# Altium schematic sheet SoC_PS_504_DDR4.SchDoc: RFSoC AMC
size 420 x 297 mm; CompanyName: WUT; DrawnBy: T. Przywozki; Organization: WUT ISE; Address1: Warsaw University of Technology; Address2: Nowowiejska 15/19 00-665 Warsaw; Address3: Tomasz.Przywozki@pw.edu.pl; DocumentNumber: 10; Revision: 1; SheetNumber: 10; SheetTotal: 45; Project: RFSoC AMC; ModifiedBy: T. Przywozki; CreateDate: -; CheckedDate: -; DivGrp: ISE; Designer: T. Przywozki; ModifiedDate: -; ProjectName: ADC/DAC MEZZANINE
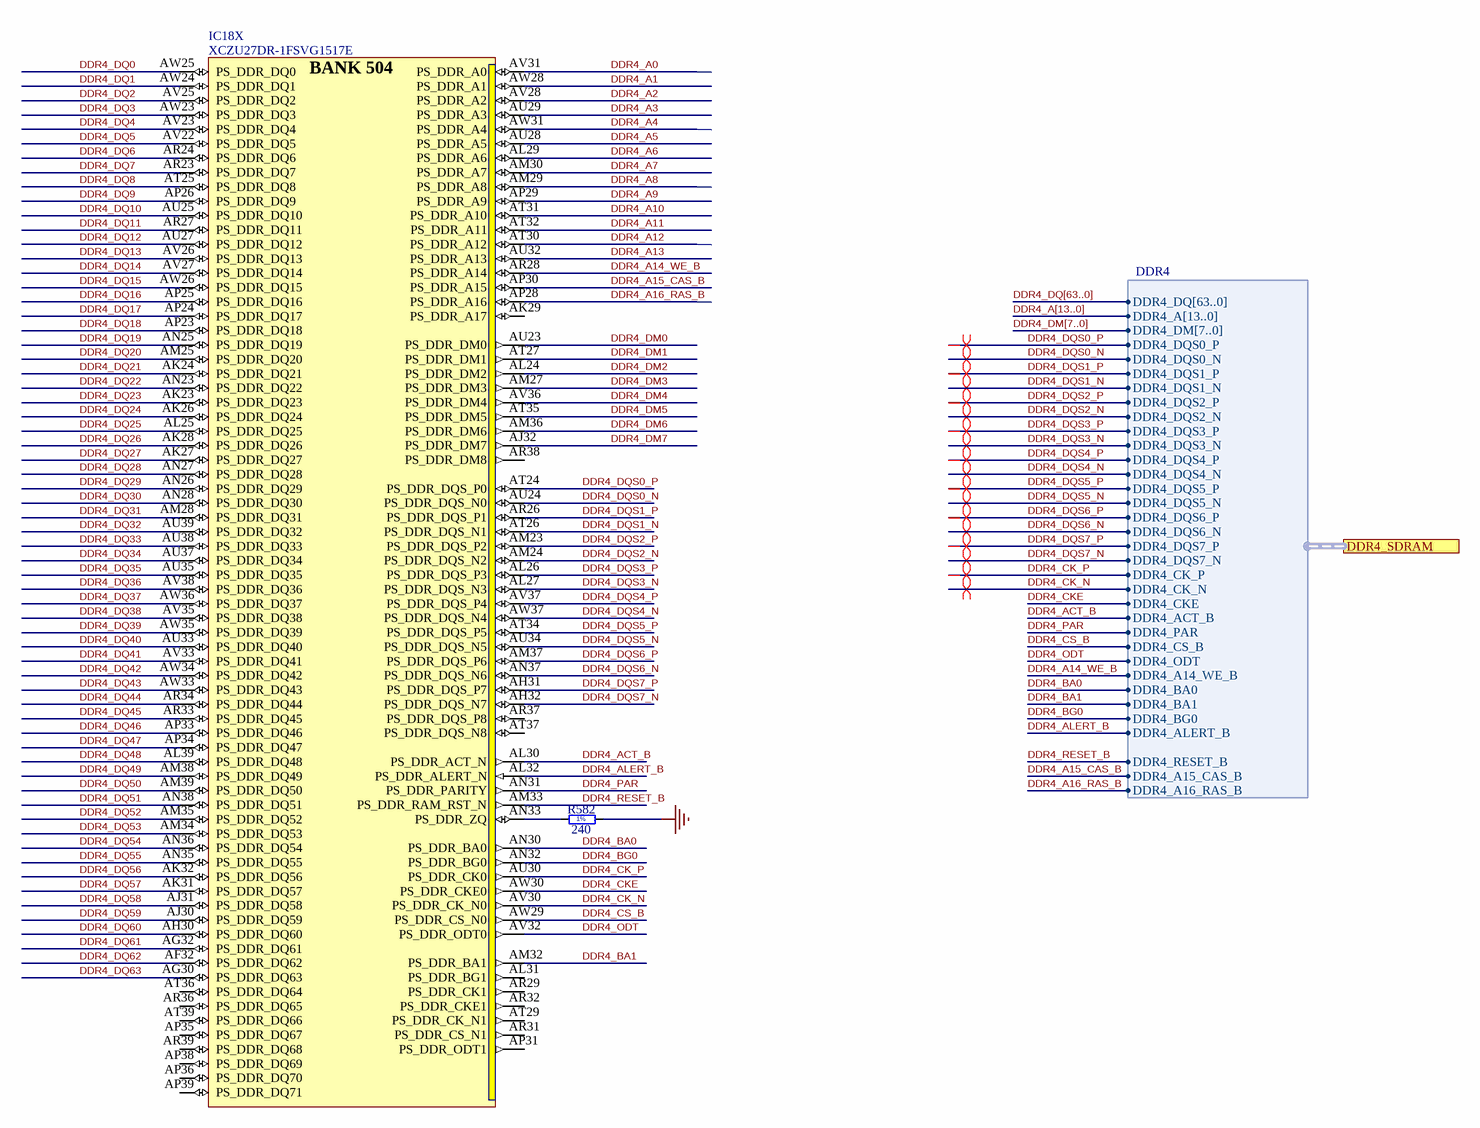
[diagram p0: SoC_PS_504_DDR4.SchDoc]

## Parts
IC18  XCZU27DR-1FSVG1517E  [XILINX_FSVG1517 (XCZU27DR)]  (part X of 31)
R582  240  [RESC1005X40N]

## Ports
DDR4_SDRAM (harness DDR4)

## Harnesses
DDR4: DDR4_DQ[63..0], DDR4_A[13..0], DDR4_DM[7..0], DDR4_DQS0_P, DDR4_DQS0_N, DDR4_DQS1_P, DDR4_DQS1_N, DDR4_DQS2_P, DDR4_DQS2_N, DDR4_DQS3_P, DDR4_DQS3_N, DDR4_DQS4_P, DDR4_DQS4_N, DDR4_DQS5_P, DDR4_DQS5_N, DDR4_DQS6_P, DDR4_DQS6_N, DDR4_DQS7_P, DDR4_DQS7_N, DDR4_CK_P, DDR4_CK_N, DDR4_CKE, DDR4_ACT_B, DDR4_PAR, DDR4_CS_B, DDR4_ODT, DDR4_A14_WE_B, DDR4_BA0, DDR4_BA1, DDR4_BG0, DDR4_ALERT_B, DDR4_RESET_B, DDR4_A15_CAS_B, DDR4_A16_RAS_B

## Nets
GND: R582.2
DDR4_A0: IC18.AV31(PS_DDR_A0)
DDR4_A1: IC18.AW28(PS_DDR_A1)
DDR4_A2: IC18.AV28(PS_DDR_A2)
DDR4_A3: IC18.AU29(PS_DDR_A3)
DDR4_A4: IC18.AW31(PS_DDR_A4)
DDR4_A5: IC18.AU28(PS_DDR_A5)
DDR4_A6: IC18.AL29(PS_DDR_A6)
DDR4_A7: IC18.AM30(PS_DDR_A7)
DDR4_A8: IC18.AM29(PS_DDR_A8)
DDR4_A9: IC18.AP29(PS_DDR_A9)
DDR4_A10: IC18.AT31(PS_DDR_A10)
DDR4_A11: IC18.AT32(PS_DDR_A11)
DDR4_A12: IC18.AT30(PS_DDR_A12)
DDR4_A13: IC18.AU32(PS_DDR_A13)
DDR4_A14_WE_B: IC18.AR28(PS_DDR_A14) ; port DDR4_SDRAM.DDR4_A14_WE_B
DDR4_A15_CAS_B: IC18.AP30(PS_DDR_A15) ; port DDR4_SDRAM.DDR4_A15_CAS_B
DDR4_A16_RAS_B: IC18.AP28(PS_DDR_A16) ; port DDR4_SDRAM.DDR4_A16_RAS_B
DDR4_ACT_B: IC18.AL30(PS_DDR_ACT_N) ; port DDR4_SDRAM.DDR4_ACT_B
DDR4_ALERT_B: IC18.AL32(PS_DDR_ALERT_N) ; port DDR4_SDRAM.DDR4_ALERT_B
DDR4_BA0: IC18.AN30(PS_DDR_BA0) ; port DDR4_SDRAM.DDR4_BA0
DDR4_BA1: IC18.AM32(PS_DDR_BA1) ; port DDR4_SDRAM.DDR4_BA1
DDR4_BG0: IC18.AN32(PS_DDR_BG0) ; port DDR4_SDRAM.DDR4_BG0
DDR4_CK_N: IC18.AV30(PS_DDR_CK_N0) ; port DDR4_SDRAM.DDR4_CK_N
DDR4_CK_P: IC18.AU30(PS_DDR_CK0) ; port DDR4_SDRAM.DDR4_CK_P
DDR4_CKE: IC18.AW30(PS_DDR_CKE0) ; port DDR4_SDRAM.DDR4_CKE
DDR4_CS_B: IC18.AW29(PS_DDR_CS_N0) ; port DDR4_SDRAM.DDR4_CS_B
DDR4_DM0: IC18.AU23(PS_DDR_DM0)
DDR4_DM1: IC18.AT27(PS_DDR_DM1)
DDR4_DM2: IC18.AL24(PS_DDR_DM2)
DDR4_DM3: IC18.AM27(PS_DDR_DM3)
DDR4_DM4: IC18.AV36(PS_DDR_DM4)
DDR4_DM5: IC18.AT35(PS_DDR_DM5)
DDR4_DM6: IC18.AM36(PS_DDR_DM6)
DDR4_DM7: IC18.AJ32(PS_DDR_DM7)
DDR4_DQ0: IC18.AW25(PS_DDR_DQ0)
DDR4_DQ1: IC18.AW24(PS_DDR_DQ1)
DDR4_DQ2: IC18.AV25(PS_DDR_DQ2)
DDR4_DQ3: IC18.AW23(PS_DDR_DQ3)
DDR4_DQ4: IC18.AV23(PS_DDR_DQ4)
DDR4_DQ5: IC18.AV22(PS_DDR_DQ5)
DDR4_DQ6: IC18.AR24(PS_DDR_DQ6)
DDR4_DQ7: IC18.AR23(PS_DDR_DQ7)
DDR4_DQ8: IC18.AT25(PS_DDR_DQ8)
DDR4_DQ9: IC18.AP26(PS_DDR_DQ9)
DDR4_DQ10: IC18.AU25(PS_DDR_DQ10)
DDR4_DQ11: IC18.AR27(PS_DDR_DQ11)
DDR4_DQ12: IC18.AU27(PS_DDR_DQ12)
DDR4_DQ13: IC18.AV26(PS_DDR_DQ13)
DDR4_DQ14: IC18.AV27(PS_DDR_DQ14)
DDR4_DQ15: IC18.AW26(PS_DDR_DQ15)
DDR4_DQ16: IC18.AP25(PS_DDR_DQ16)
DDR4_DQ17: IC18.AP24(PS_DDR_DQ17)
DDR4_DQ18: IC18.AP23(PS_DDR_DQ18)
DDR4_DQ19: IC18.AN25(PS_DDR_DQ19)
DDR4_DQ20: IC18.AM25(PS_DDR_DQ20)
DDR4_DQ21: IC18.AK24(PS_DDR_DQ21)
DDR4_DQ22: IC18.AN23(PS_DDR_DQ22)
DDR4_DQ23: IC18.AK23(PS_DDR_DQ23)
DDR4_DQ24: IC18.AK26(PS_DDR_DQ24)
DDR4_DQ25: IC18.AL25(PS_DDR_DQ25)
DDR4_DQ26: IC18.AK28(PS_DDR_DQ26)
DDR4_DQ27: IC18.AK27(PS_DDR_DQ27)
DDR4_DQ28: IC18.AN27(PS_DDR_DQ28)
DDR4_DQ29: IC18.AN26(PS_DDR_DQ29)
DDR4_DQ30: IC18.AN28(PS_DDR_DQ30)
DDR4_DQ31: IC18.AM28(PS_DDR_DQ31)
DDR4_DQ32: IC18.AU39(PS_DDR_DQ32)
DDR4_DQ33: IC18.AU38(PS_DDR_DQ33)
DDR4_DQ34: IC18.AU37(PS_DDR_DQ34)
DDR4_DQ35: IC18.AU35(PS_DDR_DQ35)
DDR4_DQ36: IC18.AV38(PS_DDR_DQ36)
DDR4_DQ37: IC18.AW36(PS_DDR_DQ37)
DDR4_DQ38: IC18.AV35(PS_DDR_DQ38)
DDR4_DQ39: IC18.AW35(PS_DDR_DQ39)
DDR4_DQ40: IC18.AU33(PS_DDR_DQ40)
DDR4_DQ41: IC18.AV33(PS_DDR_DQ41)
DDR4_DQ42: IC18.AW34(PS_DDR_DQ42)
DDR4_DQ43: IC18.AW33(PS_DDR_DQ43)
DDR4_DQ44: IC18.AR34(PS_DDR_DQ44)
DDR4_DQ45: IC18.AR33(PS_DDR_DQ45)
DDR4_DQ46: IC18.AP33(PS_DDR_DQ46)
DDR4_DQ47: IC18.AP34(PS_DDR_DQ47)
DDR4_DQ48: IC18.AL39(PS_DDR_DQ48)
DDR4_DQ49: IC18.AM38(PS_DDR_DQ49)
DDR4_DQ50: IC18.AM39(PS_DDR_DQ50)
DDR4_DQ51: IC18.AN38(PS_DDR_DQ51)
DDR4_DQ52: IC18.AM35(PS_DDR_DQ52)
DDR4_DQ53: IC18.AM34(PS_DDR_DQ53)
DDR4_DQ54: IC18.AN36(PS_DDR_DQ54)
DDR4_DQ55: IC18.AN35(PS_DDR_DQ55)
DDR4_DQ56: IC18.AK32(PS_DDR_DQ56)
DDR4_DQ57: IC18.AK31(PS_DDR_DQ57)
DDR4_DQ58: IC18.AJ31(PS_DDR_DQ58)
DDR4_DQ59: IC18.AJ30(PS_DDR_DQ59)
DDR4_DQ60: IC18.AH30(PS_DDR_DQ60)
DDR4_DQ61: IC18.AG32(PS_DDR_DQ61)
DDR4_DQ62: IC18.AF32(PS_DDR_DQ62)
DDR4_DQ63: IC18.AG30(PS_DDR_DQ63)
DDR4_DQS0_N: IC18.AU24(PS_DDR_DQS_N0) ; port DDR4_SDRAM.DDR4_DQS0_N
DDR4_DQS0_P: IC18.AT24(PS_DDR_DQS_P0) ; port DDR4_SDRAM.DDR4_DQS0_P
DDR4_DQS1_N: IC18.AT26(PS_DDR_DQS_N1) ; port DDR4_SDRAM.DDR4_DQS1_N
DDR4_DQS1_P: IC18.AR26(PS_DDR_DQS_P1) ; port DDR4_SDRAM.DDR4_DQS1_P
DDR4_DQS2_N: IC18.AM24(PS_DDR_DQS_N2) ; port DDR4_SDRAM.DDR4_DQS2_N
DDR4_DQS2_P: IC18.AM23(PS_DDR_DQS_P2) ; port DDR4_SDRAM.DDR4_DQS2_P
DDR4_DQS3_N: IC18.AL27(PS_DDR_DQS_N3) ; port DDR4_SDRAM.DDR4_DQS3_N
DDR4_DQS3_P: IC18.AL26(PS_DDR_DQS_P3) ; port DDR4_SDRAM.DDR4_DQS3_P
DDR4_DQS4_N: IC18.AW37(PS_DDR_DQS_N4) ; port DDR4_SDRAM.DDR4_DQS4_N
DDR4_DQS4_P: IC18.AV37(PS_DDR_DQS_P4) ; port DDR4_SDRAM.DDR4_DQS4_P
DDR4_DQS5_N: IC18.AU34(PS_DDR_DQS_N5) ; port DDR4_SDRAM.DDR4_DQS5_N
DDR4_DQS5_P: IC18.AT34(PS_DDR_DQS_P5) ; port DDR4_SDRAM.DDR4_DQS5_P
DDR4_DQS6_N: IC18.AN37(PS_DDR_DQS_N6) ; port DDR4_SDRAM.DDR4_DQS6_N
DDR4_DQS6_P: IC18.AM37(PS_DDR_DQS_P6) ; port DDR4_SDRAM.DDR4_DQS6_P
DDR4_DQS7_N: IC18.AH32(PS_DDR_DQS_N7) ; port DDR4_SDRAM.DDR4_DQS7_N
DDR4_DQS7_P: IC18.AH31(PS_DDR_DQS_P7) ; port DDR4_SDRAM.DDR4_DQS7_P
DDR4_ODT: IC18.AV32(PS_DDR_ODT0) ; port DDR4_SDRAM.DDR4_ODT
DDR4_PAR: IC18.AN31(PS_DDR_PARITY) ; port DDR4_SDRAM.DDR4_PAR
DDR4_RESET_B: IC18.AM33(PS_DDR_RAM_RST_N) ; port DDR4_SDRAM.DDR4_RESET_B
NetIC18_AN33: IC18.AN33(PS_DDR_ZQ) R582.1

Not connected (* = marked no-connect by the designer): IC18 AK29(PS_DDR_A17) AL31(PS_DDR_BG1) AP31(PS_DDR_ODT1) AP35(PS_DDR_DQ67) AP36(PS_DDR_DQ70) AP38(PS_DDR_DQ69) AP39(PS_DDR_DQ71) AR29(PS_DDR_CK1) AR31(PS_DDR_CS_N1) AR32(PS_DDR_CKE1) AR36(PS_DDR_DQ65) AR37(PS_DDR_DQS_P8) AR38(PS_DDR_DM8) AR39(PS_DDR_DQ68) AT29(PS_DDR_CK_N1) AT36(PS_DDR_DQ64) AT37(PS_DDR_DQS_N8) AT39(PS_DDR_DQ66)

## Buses and harness runs
bus DDR4_A[13..0]
bus DDR4_DM[7..0]
bus DDR4_DQ[63..0]

## Layout directives
differential pair: DDR4_CK_N, DDR4_CK_P, DDR4_DQS0_N, DDR4_DQS0_P, DDR4_DQS1_N, DDR4_DQS1_P, DDR4_DQS2_N, DDR4_DQS2_P, DDR4_DQS3_N, DDR4_DQS3_P, DDR4_DQS4_N, DDR4_DQS4_P, DDR4_DQS5_N, DDR4_DQS5_P, DDR4_DQS6_N, DDR4_DQS6_P, DDR4_DQS7_N, DDR4_DQS7_P

## Notes on the sheet
- Project/Equipment
- Document
- Designer
- Drawn by
- Check.by
- Copyright WUT ISE 2021
  This documentation describes Open Hardware and is licensed under CERN OHL v.1.1. You may redistribute and modify this documentaction under the terms of the CERN OHL v1.1.
  (http://ohwr.org/CERNOHL). This documentation is dristributed WITHOUT ANY EXPRESS OR IMPLIED WARRANTY, INCLUDING OF MERCHANTABLITY, SATISFACTORY QUALITY AND FITNESS FOR A PARTICULAR PURPOSE. Please see the CERN OHL v.1.1 for applicable conditions
- File
- Last Mod.
- Print Date
- Sheet
- Size
- A3
- of
- Rev
- Contact:
- (in symbol R0402_240R_1%_0.0625W_100PPM) 1%
- (in symbol XCZU27DR-1FSVG1517E, part X) BANK 504

## Library data of the parts
IC18 = XCZU27DR-1FSVG1517E: Zynq UltraScale+ RFSoC, Quad-Core ARM® Cortex™-A53 MPCore™ up to 1.5GHz, 214 PS I/O, 299 HP I/O, 48 HD I/O, 1517-Pin BGA; Manufacturer: XILINX; PressFit: No; Bonding: No; Part Number: XCZU27DR-1FSVG1517E; Component Kind: Standard; Component Type: Standard; Device: XCZU27DR-1FSVG1517E; PackageDescription: BGA, 1.00mm Pitch, Square; 1517 Pin, 39 Columns X 39 Rows, 40.00mm X 40.00mm X 4.01mm H; Part Description: Zynq UltraScale+ RFSoC, Quad-Core ARM® Cortex™-A53 MPCore™ up to 1.5GHz, 214 PS I/O, 299 HP I/O, 48 HD I/O, 1517-Pin BGA; Manufacturer Part Number: XCZU27DR-1FSVG1517E; Pin Count: 1517; Case: BGA1517; Mounted: Yes; Socket: No; SMD: Yes; Sense: No; ComponentHeight: 4.01mm; HelpURL: \\cern.ch\dfs\Applications\Altium\Datasheets\XCZU27DR-1FSVG1517E.pdf; ComponentLink1URL: \\cern.ch\dfs\Applications\Altium\Datasheets\XCZU27DR-1FSVG1517E_Package-Pinout.pdf; ComponentLink1Description: Package/Pinout; ComponentLink2URL: \\cern.ch\dfs\Applications\Altium\Datasheets\XCZU27DR-1FSVG1517E_Pinout.pdf; ComponentLink2Description: Pinout; Author: CERN DEM MR; CreateDate: 02/05/2018; LatestRevisionDate: 02/05/2018
R582 = R0402_240R_1%_0.0625W_100PPM: Resistor - 1%; Manufacturer: GENERIC; Part Description: General Purpose Thick Film Chip Resistor; Manufacturer1 Part Number: 232270672401L; TC: ±100ppm/°C; PressFit: No; Manufacturer Part Number: R0402_240R_1%_0.0625W_100PPM; Part Number: R0402_240R_1%_0.0625W_100PPM; Tolerance: ±1%; Value: 240; Component Kind: Standard; Component Type: Standard; Pin Count: 2; Status: Not Recommended; Power: 0.0625W; Case: 0402; Mounted: Yes; Sense: No; Socket: No; SMD: Yes; Manufacturer1 Example: YAGEO PHYCOMP; Manufacturer1 ComponentHeight: 0.4mm; HelpURL: \\cern.ch\dfs\Applications\Altium\Datasheets\R0402_Phycomp_RC0402.pdf; Author: CERN DEM JLC; CreateDate: 03/12/2007; LatestRevisionDate: 17/10/2012